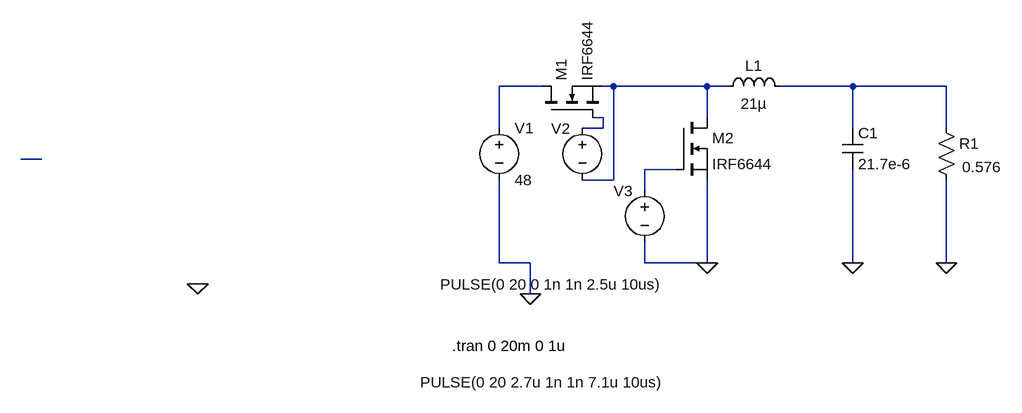
[diagram p0: schematic @synchronousbuck_16 final.asc]
@synchronousbuck_16 final.asc, the LTspice schematic file:
Version 4
SHEET 1 880 680
WIRE -80 16 -144 16
WIRE 32 16 16 16
WIRE 176 16 32 16
WIRE 208 16 176 16
WIRE 400 16 288 16
WIRE 544 16 400 16
WIRE 16 64 0 64
WIRE 176 64 176 16
WIRE -144 80 -144 16
WIRE 16 80 16 64
WIRE 16 80 -16 80
WIRE 400 80 400 16
WIRE 544 80 544 16
WIRE -848 128 -880 128
WIRE 128 144 80 144
WIRE 32 160 32 16
WIRE 32 160 -16 160
WIRE 80 176 80 144
WIRE -144 288 -144 160
WIRE -96 288 -144 288
WIRE 80 288 80 256
WIRE 176 288 176 160
WIRE 176 288 80 288
WIRE 400 288 400 144
WIRE 544 288 544 160
WIRE -96 336 -96 288
FLAG -96 336 0
FLAG 176 288 0
FLAG 400 288 0
FLAG 544 288 0
FLAG -608 320 0
DATAFLAG 80 144 ""
DATAFLAG 80 144 ""
DATAFLAG 80 144 ""
DATAFLAG 544 32 ""
SYMBOL cap 384 80 R0
SYMATTR InstName C1
SYMATTR Value 21.7e-6
SYMATTR SpiceLine Rser=0
SYMBOL ind 192 32 R270
WINDOW 0 32 56 VTop 2
WINDOW 3 5 56 VBottom 2
SYMATTR InstName L1
SYMATTR Value 21µ
SYMATTR SpiceLine Rser=0
SYMBOL res 528 64 R0
WINDOW 3 40 76 Left 2
SYMATTR Value 0.576
SYMATTR InstName R1
SYMBOL voltage -144 64 R0
WINDOW 123 0 0 Left 0
WINDOW 39 0 0 Left 0
SYMATTR InstName V1
SYMATTR Value 48
SYMBOL nmos -80 64 R270
SYMATTR InstName M1
SYMATTR Value IRF6644
SYMBOL voltage -16 64 R0
WINDOW 123 0 0 Left 0
WINDOW 39 0 0 Left 0
WINDOW 0 -48 17 Left 2
WINDOW 3 -219 257 Left 2
SYMATTR InstName V2
SYMATTR Value PULSE(0 20 0 1n 1n 2.5u 10us)
SYMBOL nmos 128 64 R0
SYMATTR InstName M2
SYMATTR Value IRF6644
SYMBOL voltage 80 160 R0
WINDOW 123 0 0 Left 0
WINDOW 39 0 0 Left 0
WINDOW 0 -48 17 Left 2
WINDOW 3 31 312 Right 2
SYMATTR InstName V3
SYMATTR Value PULSE(0 20 2.7u 1n 1n 7.1u 10us)
TEXT -216 416 Left 2 !.tran 0 20m 0 1u

The netlist it stands for:
* @synchronousbuck_16 final.asc
C1 N003 0 21.7e-6 Rser=0
L1 N002 N003 21µ Rser=0
R1 N003 0 0.576
V1 N001 0 48
M1 N001 N004 N002 N002 IRF6644
V2 N004 N002 PULSE(0 20 0 1n 1n 2.5u 10us)
M2 N002 N006 0 0 IRF6644
V3 N006 0 PULSE(0 20 2.7u 1n 1n 7.1u 10us)
.model NMOS NMOS
.model PMOS PMOS
.lib standard.mos
.tran 0 20m 0 1u
.backanno
.end